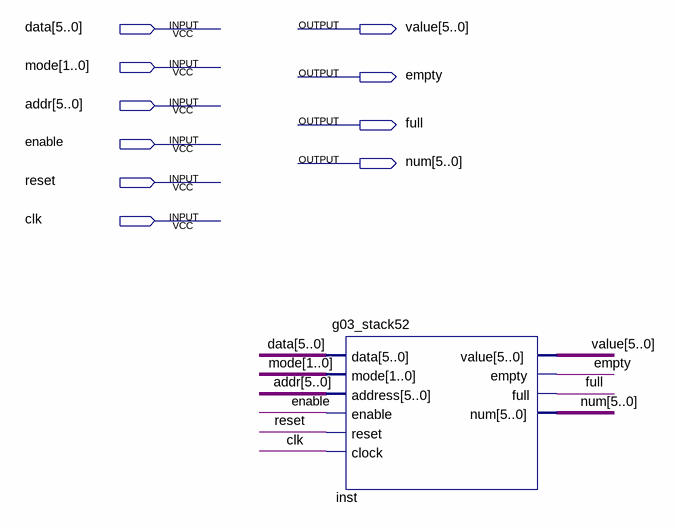
[diagram p0: schematic sheet]
// Quartus schematic g03_lab3_stack.bdf as structural Verilog: 1 symbols, 10 pins
module g03_lab3_stack (
  input  [5:0] data,
  input  [1:0] mode,
  input  [5:0] addr,
  input  enable,
  input  reset,
  input  clk,
  output [5:0] value,
  output empty,
  output full,
  output [5:0] num
);

  g03_stack52 inst (
    .data(data), .mode(mode), .address(addr), .enable(enable), .reset(reset), .clock(clk), .value(value),
    .empty(empty), .full(full), .num(num));
endmodule
